# EAGLE design Top board (EAGLE 9.6.2)
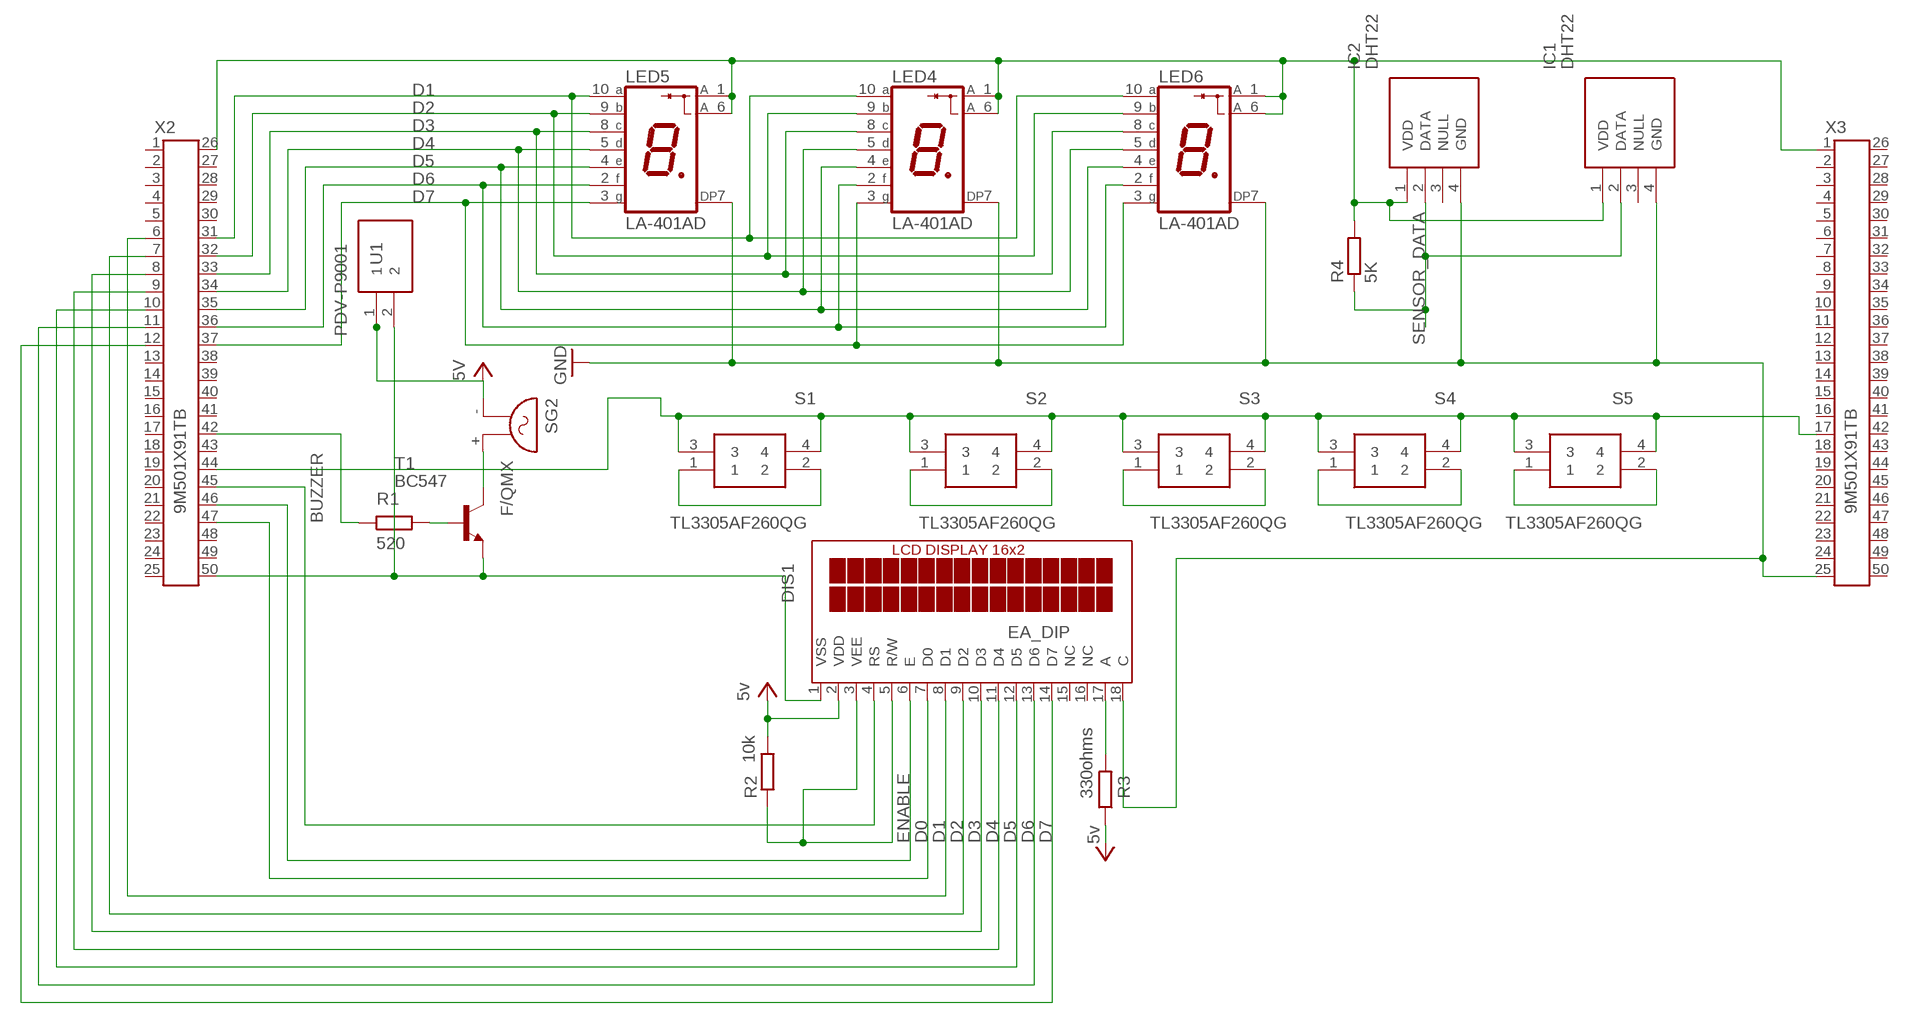
[diagram p0: schematic, sheet 1]

## Parts
DIS1  EA_DIP  [EA_DIP]
IC1  DHT22  [DHT22]
IC2  DHT22  [DHT22]
LED4  LA-401AD  [LA-401]
LED5  LA-401AD  [LA-401]
LED6  LA-401AD  [LA-401]
R1  520  R  (no package)
R2  10k  R-EU_0204/2V  [0204V]
R3  330ohms  R-EU_0204/2V  [0204V]
R4  5K  R-EU_0204/2V  [0204V]
S1  TL3305AF260QG  [TL3305AF160QG]
S2  TL3305AF260QG  [TL3305AF160QG]
S3  TL3305AF260QG  [TL3305AF160QG]
S4  TL3305AF260QG  [TL3305AF160QG]
S5  TL3305AF260QG  [TL3305AF160QG]
SG2  F/QMX  [F/QMX]
T1  BC547  [TO92]
U1  PDV-P9001  [PDVP9001]
X2  9M501X91TB  [9M501X91]
X3  9M501X91TB  [9M501X91]

## Nets
BUZZER: R1.1 X2.42
D0: DIS1.7(D0) X2.47
D1: DIS1.8(D1) LED4.10(A) LED5.10(A) LED6.10(A) X2.6 X2.31
D2: DIS1.9(D2) LED4.9(B) LED5.9(B) LED6.9(B) X2.7 X2.32
D3: DIS1.10(D3) LED4.8(C) LED5.8(C) LED6.8(C) X2.8 X2.33
D4: DIS1.11(D4) LED4.5(D) LED5.5(D) LED6.5(D) X2.9 X2.34
D5: DIS1.12(D5) LED4.4(E) LED5.4(E) LED6.4(E) X2.10 X2.35
D6: DIS1.13(D6) LED4.2(F) LED5.2(F) LED6.2(F) X2.11 X2.36
D7: DIS1.14(D7) LED4.3(G) LED5.3(G) LED6.3(G) X2.12 X2.37
ENABLE: DIS1.6(E) X2.46
GND: DIS1.18(C) IC1.4(GND) IC2.4(GND) LED4.7(DP) LED5.7(DP) LED6.7(DP) X3.25
N$1: R1.2 T1.2(B)
N$2: SG2.+ T1.3(C)
N$4: DIS1.4(RS) X2.45
N$5: DIS1.3(VEE) DIS1.5(R/W) R2.1
N$6: DIS1.1(VSS) T1.1(E) U1.2 X2.50
N$7: S1.3 S1.4 S2.3 S2.4 S3.3 S3.4 S4.3 S4.4 S5.3 S5.4 X2.44 X3.17
N$10: IC1.1(VDD) IC2.1(VDD) LED4.1(A) LED4.6(A) LED5.1(A) LED5.6(A) LED6.1(A) LED6.6(A) R4.2 X2.26 X3.1
N$12: S1.1 S1.2
N$23: DIS1.17(A) R3.2
N$25: S2.1 S2.2
N$26: S3.1 S3.2
N$29: S4.1 S4.2
N$31: S5.1 S5.2
SENSOR_DATA: IC1.2(DATA) IC2.2(DATA) R4.1
VCC: DIS1.2(VDD) R2.2 R3.1 SG2.- U1.1 ; supply symbol labelled 5V, 5v
Unconnected: DIS1.15(NC) DIS1.16(NC) IC1.3(NULL) IC2.3(NULL) X2.1 X2.2 X2.3 X2.4 X2.5 X2.13 X2.14 X2.15 X2.16 X2.17 X2.18 X2.19 X2.20 X2.21 X2.22 X2.23 X2.24 X2.25 X2.27 X2.28 X2.29 X2.30 X2.38 X2.39 X2.40 X2.41 X2.43 X2.48 X2.49 X3.2 X3.3 X3.4 X3.5 X3.6 X3.7 X3.8 X3.9 X3.10 X3.11 X3.12 X3.13 X3.14 X3.15 X3.16 X3.18 X3.19 X3.20 X3.21 X3.22 X3.23 X3.24 X3.26 X3.27 X3.28 X3.29 X3.30 X3.31 X3.32 X3.33 X3.34 X3.35 X3.36 X3.37 X3.38 X3.39 X3.40 X3.41 X3.42 X3.43 X3.44 X3.45 X3.46 X3.47 X3.48 X3.49 X3.50

## Library data of the parts
DIS1 = display-lcd:EA_DIP: LCD-MODUL 2x16 - 6,68mm, INKL. KONTROLLER HD44780 Source: Data sheet <http://www.lcd-module.de/pdf/doma/dip162-d.pdf>
IC1 IC2 = DHT22:DHT22: Digital-output relative humidity & temperature sensor/module DHT22 Source: Datasheet <https://datasheet4u.com/datasheet-parts/DHT22-datasheet.php?id=792211>; ARROW_PART_NUMBER: DHT22; DESCRIPTION: Digital-output relative humidity & temperature sensor/module DHT22; HEIGHT: 25.1mm; MANUFACTURER_NAME: Aosong Electronics; MANUFACTURER_PART_NUMBER: DHT22
LED4-LED6 = led-7-segment:LA-401*D: Single Digit LED Numeric Display (anode common) Source: ROHM .. la-1401dn.pdf; OC_FARNELL: unknown; OC_NEWARK: unknown
R1 = ngspice-simulation:R: RESISTOR
R2-R4 = rcl:R-EU_: RESISTOR, European symbol; SPICEPREFIX: R
S1-S5 = TL3305AF260QG:TL3305AF260QG: E-SWITCH - TL3305AF260QG - TACTILE SW, SPST, 0.05A, 12VDC, SOLDER Source: Datasheet <https://componentsearchengine.com/Datasheets/1/TL3305AF260QG.pdf>; ARROW_PART_NUMBER: TL3305AF260QG; DESCRIPTION: E-SWITCH - TL3305AF260QG - TACTILE SW, SPST, 0.05A, 12VDC, SOLDER; HEIGHT: mm; MANUFACTURER_NAME: E-Switch; MANUFACTURER_PART_NUMBER: TL3305AF260QG; MOUSER_PART_NUMBER: 612-TL3305AF260QG; MOUSER_PRICE-STOCK: https://www.mouser.co.uk/ProductDetail/E-Switch/TL3305AF260QG?qs=UrFqKgNWc7QGfGfc5KSA7A%3D%3D
SG2 = buzzer:F/QMX: BUZZER Source: Buerklin; OC_FARNELL: unknown; OC_NEWARK: unknown
T1 = transistor:BC547: NPN TRANSISTOR
U1 = PDV-P9001:PDV-P9001: PHOTOCELL 4K-11K OHM 4.20MM Source: Datasheet <https://media.digikey.com/pdf/Data Sheets/Photonic Detetectors Inc PDFs/PDV-P9001.pdf>; ARROW_PART_NUMBER: PDV-P9001; DESCRIPTION: PHOTOCELL 4K-11K OHM 4.20MM; HEIGHT: 1.88mm; MANUFACTURER_NAME: Luna Optoelectronics; MANUFACTURER_PART_NUMBER: PDV-P9001
X2 X3 = con-3m:9M501X91TB: CONNECTOR PCMCIA-CompactFlash; OC_FARNELL: unknown; OC_NEWARK: unknown

## Board
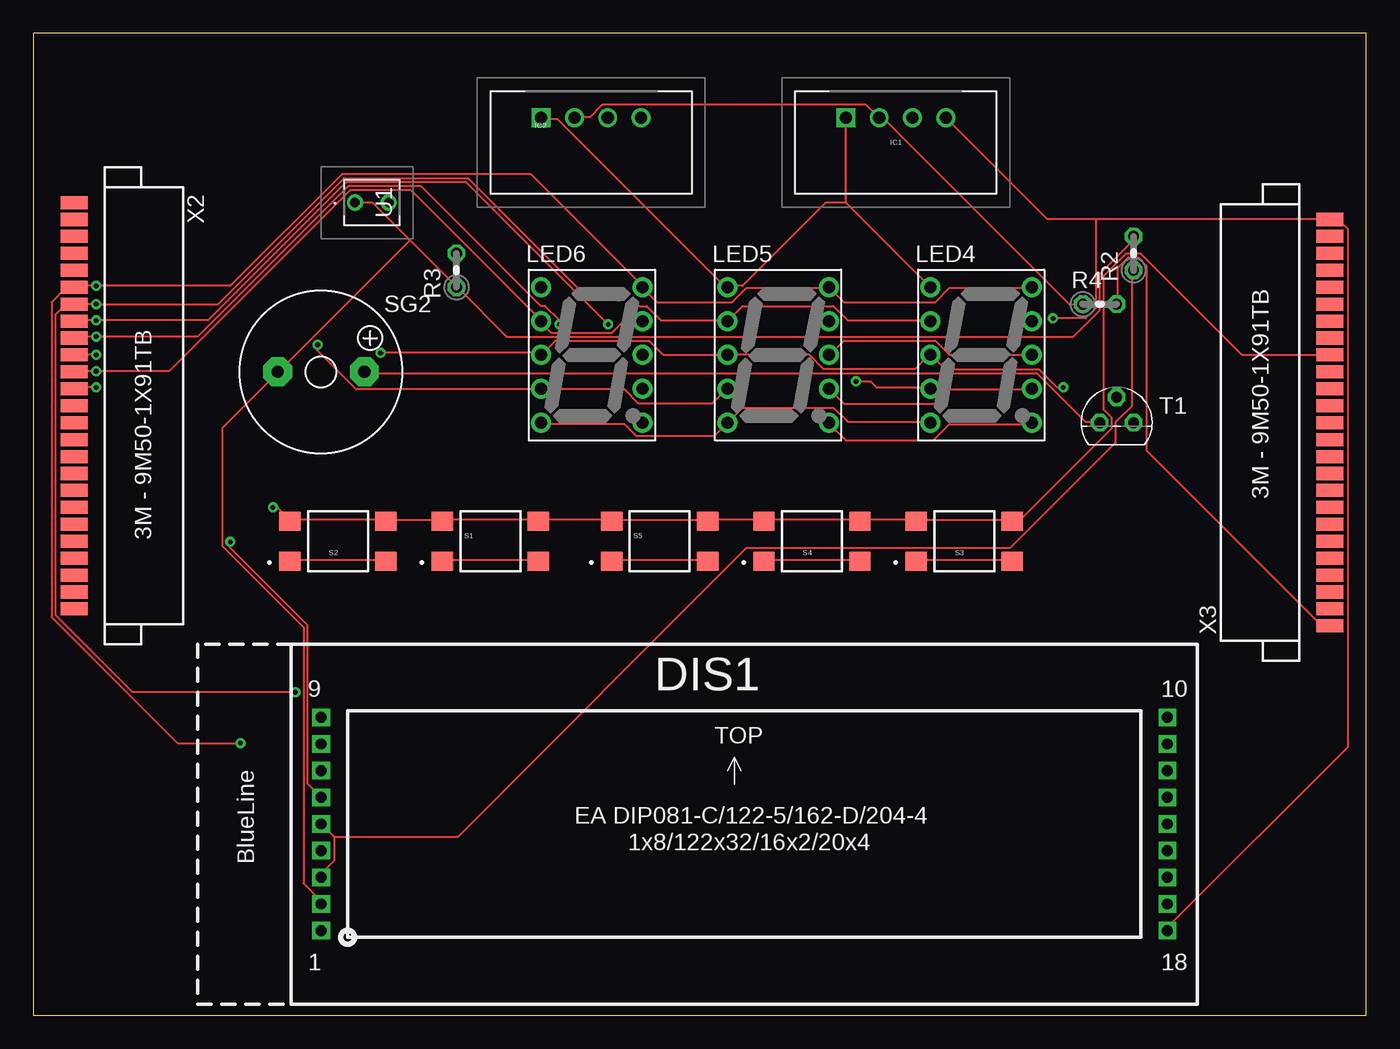
[diagram p1: board, top side]
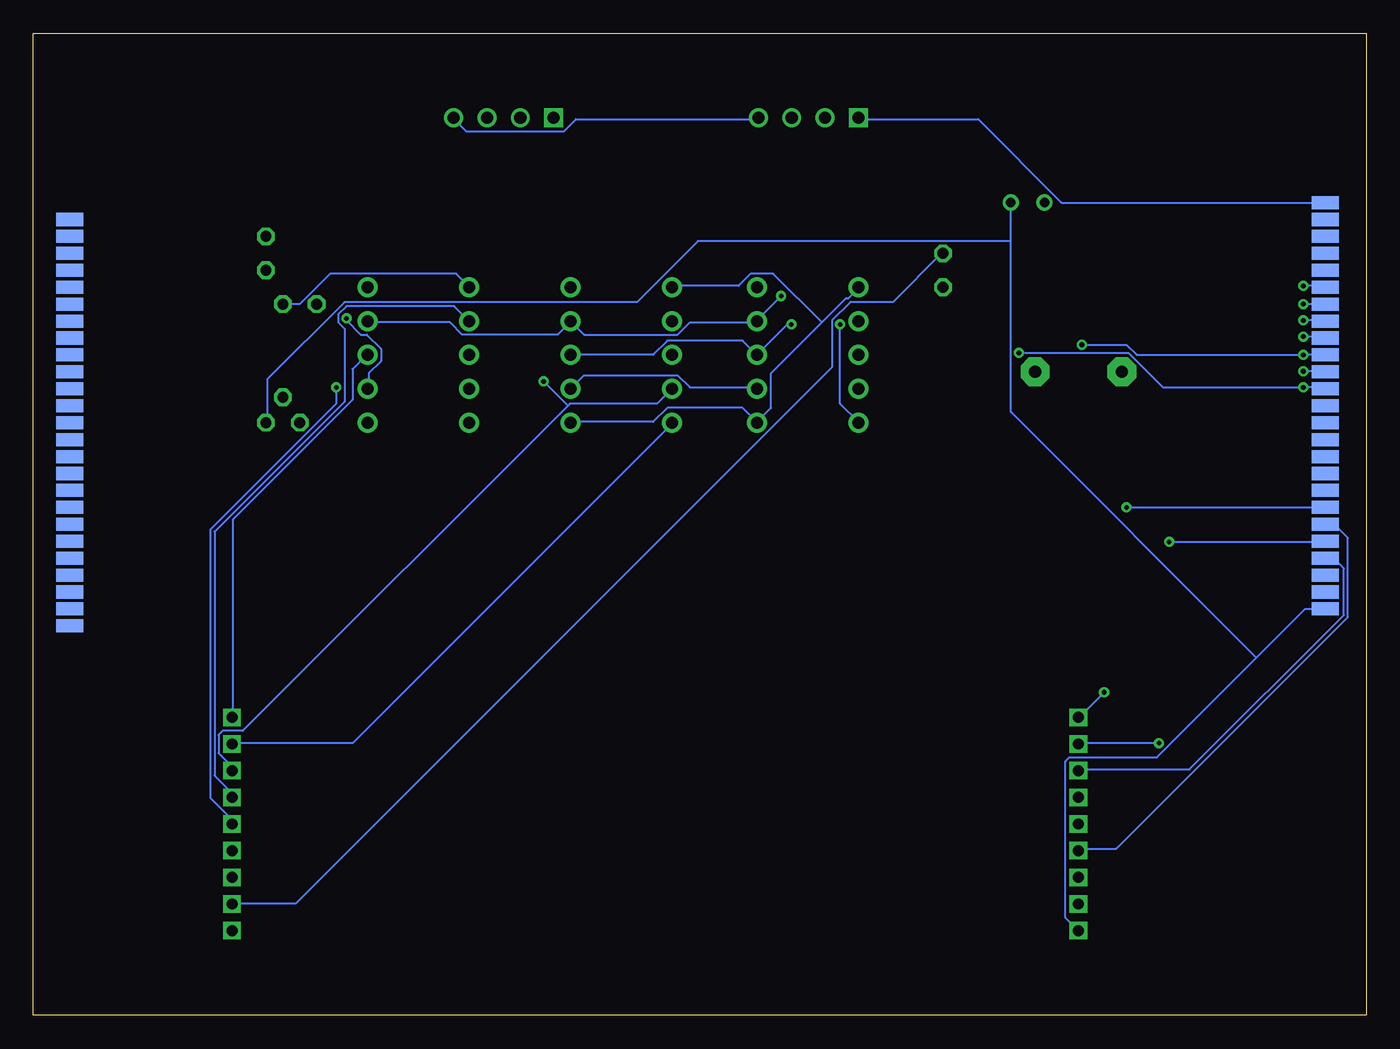
[diagram p2: board, bottom side, seen from below]

Size 100 x 73.65 mm. Coordinates in mm from the lower left corner, seen from the top.
Outline: 0,0 100,0 100,73.65 0,73.65 0,0
Copper layers (1*16): Top 0.035mm / dielectric 1.5mm / Bottom 0.035mm
Design rules "default": minimum track width 6mil, minimum drill 0.35mm, track to track 6mil, track to pad 6mil, pad to pad 6mil, via to via 6mil, smd to smd 6mil, copper to edge 40mil, drill to drill 6mil, minimum pad ring 10mil, minimum via ring 8mil, stop-mask expansion 4mil, vias tented up to drill 0mil, thermal gap 10mil

### Footprints (pad centres in the part's own frame; a part is rotated, then mirrored left to right if it is on the bottom)
EA_DIP = drill 0.813 pad 1.27 square: 1 0,0; 2 0,2; 3 0,4; 4 0,6; 5 0,8; 6 0,10; 7 0,12; 8 0,14; 9 0,16; 10 63.5,16; 11 63.5,14; 12 63.5,12; 13 63.5,10; 14 63.5,8; 15 63.5,6; 16 63.5,4; 17 63.5,2; 18 63.5,0
DHT22 = drill 0.91 pad 1.416 square: 1 0,0 | drill 0.91 pad 1.416: 2 2.5,0; 3 5,0; 4 7.5,0
LA-401 = drill 0.9 pad 1.5: 1 -3.81,5.08; 2 -3.81,2.54; 3 -3.81,0; 4 -3.81,-2.54; 5 -3.81,-5.08; 6 3.81,-5.08; 7 3.81,-2.54; 8 3.81,0; 9 3.81,2.54; 10 3.81,5.08
0204V = drill 0.813 octagon: 1 -1.27,0; 2 1.27,0
TL3305AF160QG = smd 1.6 x 1.4: 1 -3.6,-1.5; 2 3.6,-1.5; 3 -3.6,1.5; 4 3.6,1.5
F/QMX = drill 0.914 pad 2.159 octagon: + 3.251,0; - -3.251,0
TO92 = drill 0.813 octagon: 1 1.27,0; 2 0,1.905; 3 -1.27,0
PDVP9001 = drill 0.7 pad 1.2: 1 0,0; 2 0,-2.54
9M501X91 = smd 0.98 x 2.03: 1 -15.24,-3.29; 2 -13.97,-3.29; 3 -12.7,-3.29; 4 -11.43,-3.29; 5 -10.16,-3.29; 6 -8.89,-3.29; 7 -7.62,-3.29; 8 -6.35,-3.29; 9 -5.08,-3.29; 10 -3.81,-3.29; 11 -2.54,-3.29; 12 -1.27,-3.29; 13 0,-3.29; 14 1.27,-3.29; 15 2.54,-3.29; 16 3.81,-3.29; 17 5.08,-3.29; 18 6.35,-3.29; 19 7.62,-3.29; 20 8.89,-3.29; 21 10.16,-3.29; 22 11.43,-3.29; 23 12.7,-3.29; 24 13.97,-3.29; 25 15.24,-3.29 | smd 0.98 x 2.03 bottom: 26 -15.24,-3.29; 27 -13.97,-3.29; 28 -12.7,-3.29; 29 -11.43,-3.29; 30 -10.16,-3.29; 31 -8.89,-3.29; 32 -7.62,-3.29; 33 -6.35,-3.29; 34 -5.08,-3.29; 35 -3.81,-3.29; 36 -2.54,-3.29; 37 -1.27,-3.29; 38 0,-3.29; 39 1.27,-3.29; 40 2.54,-3.29; 41 3.81,-3.29; 42 5.08,-3.29; 43 6.35,-3.29; 44 7.62,-3.29; 45 8.89,-3.29; 46 10.16,-3.29; 47 11.43,-3.29; 48 12.7,-3.29; 49 13.97,-3.29; 50 15.24,-3.29

### Placement (x,y rotation side)
DIS1  21.59,6.35 0 top
IC1  60.96,67.31 0 top
IC2  38.1,67.31 0 top
LED4  71.12,49.53 0 top
LED5  55.88,49.53 0 top
LED6  41.91,49.53 0 top
R2  82.55,57.15 90 top
R3  31.75,55.88 90 top
R4  80.01,53.34 0 top
S1  34.29,35.56 0 top
S2  22.86,35.56 0 top
S3  69.85,35.56 0 top
S4  58.42,35.56 0 top
S5  46.99,35.56 0 top
SG2  21.59,48.26 0 top
T1  81.28,44.45 0 top
U1  24.13,60.96 90 top
X2  6.35,45.72 270 top
X3  93.98,44.45 90 top

### Tracks (layer width: path | path; a pad name or v marks a point on that pad's centre or on a via)
D0
  Bottom 0.152: X2.47 2.44,34.29 1.68,33.53 1.68,30.02 13.26,18.44 21.49,18.44 DIS1.7
D1  (via drill 0.35)
  Top 0.152: v15.54,20.42 10.82,20.42 1.37,29.87 1.37,53.49 2.44,54.56 3.05,54.56 X2.31 3.2,54.71 v4.72,54.71 14.78,54.71 23.16,63.09 37.34,63.09 45.72,54.71 LED6.10 45.72,54.56 46.79,53.49 52.43,53.49 53.49,54.56 59.59,54.56 LED5.10 60.81,53.49 67.67,53.49 68.73,54.56 74.83,54.56 LED4.10
  Bottom 0.152: v4.72,54.71 3.2,54.71 X2.31 | v15.54,20.42 21.49,20.42 DIS1.8
D2  (via drill 0.35)
  Top 0.152: v19.66,24.23 7.47,24.23 1.68,30.02 1.68,52.58 2.44,53.34 X2.32 v4.72,53.34 13.87,53.34 23.32,62.79 32.61,62.79 41.45,53.95 v43.89,53.95
  Bottom 0.152: LED4.9 74.83,51.97 68.73,51.97 67.82,51.05 60.66,51.05 59.74,51.97 LED5.9 58.67,51.05 51.66,51.05 50.75,51.97 45.72,51.97 LED6.9 45.72,52.12 v43.89,53.95 | X2.32 v4.72,53.34 | v19.66,24.23 21.49,22.4 DIS1.9
D3  (via drill 0.35)
  Top 0.152: X2.33 3.2,52.12 v4.72,52.12 13.11,52.12 23.47,62.48 32.46,62.48 v43.13,51.82 | LED4.8 68.73,49.53 67.67,50.6 60.81,50.6 59.74,49.53 LED5.8
  Bottom 0.152: DIS1.10 85.04,22.4 85.04,37.19 76.05,46.18 76.05,48.46 74.98,49.53 LED4.8 | v4.72,52.12 3.2,52.12 X2.33 | v43.13,51.82 43.43,51.82 LED6.8 46.79,50.6 52.43,50.6 53.49,49.53 LED5.8
D4  (via drill 0.35)
  Top 0.152: X2.34 3.2,50.9 v4.72,50.9 12.34,50.9 23.62,62.18 29.11,62.18 38.1,53.19 38.41,53.19 39.47,52.12 v39.47,51.82 | LED4.5 67.21,44.5 61.11,44.5 60.05,45.57 53.19,45.57 LED5.5 51.05,43.43 45.26,43.43 44.35,44.35 38.1,44.35 LED6.5
  Bottom 0.152: v4.72,50.9 3.2,50.9 X2.34 | v39.47,51.82 39.47,45.87 38.1,44.5 LED6.5 | DIS1.11 85.04,20.42 76.05,20.42 52.12,44.35 LED5.5
D5  (via drill 0.35)
  Top 0.152: v4.72,49.53 X2.35 | v21.34,50.29 21.34,49.84 24.23,46.94 38.1,46.94 | v61.72,47.55 62.79,47.55 63.25,47.09 67.21,47.09 LED4.4 | 38.1,46.94 44.35,46.94 45.41,45.87 50.9,45.87 51.97,46.94 LED5.4 | 38.1,46.94 LED6.4
  Bottom 0.152: X2.35 v4.72,49.53 17.22,49.53 17.98,50.29 v21.34,50.29 | 59.89,45.72 59.74,45.87 53.19,45.87 LED5.4 | 59.89,45.72 84.28,21.34 85.8,21.34 86.11,21.03 86.11,19.66 85.19,18.75 85.19,18.44 DIS1.12 | 59.89,45.72 v61.72,47.55
D6  (via drill 0.35)
  Top 0.152: X2.36 3.2,48.31 v4.72,48.31 10.21,48.31 23.77,61.87 28.35,61.87 38.1,52.12 LED6.2 38.1,51.97 38.86,51.21 43.43,51.21 45.41,53.19 46.02,53.19 47.09,52.12 51.97,52.12 LED5.2 53.19,53.19 60.05,53.19 61.11,52.12 67.21,52.12 LED4.2
  Bottom 0.152: LED4.2 68.43,53.19 76.5,53.19 77.11,52.58 77.11,51.97 76.66,51.51 76.66,46.02 86.41,36.27 86.41,17.98 85.19,16.76 85.19,16.46 DIS1.13 | v4.72,48.31 3.2,48.31 X2.36
D7  (via drill 0.35)
  Top 0.152: v4.72,47.09 3.2,47.09 X2.37 | v26.06,49.68 37.95,49.68 LED6.3 39.17,50.6 46.18,50.6 47.24,49.53 LED5.3 58.22,49.53 59.28,48.46 66.14,48.46 67.21,49.53 LED4.3 67.36,49.53 68.43,48.46 75.44,48.46 76.81,47.09 v77.27,47.09
  Bottom 0.152: X2.37 3.2,47.09 v4.72,47.09 15.24,47.09 17.83,49.68 v26.06,49.68 | v77.27,47.09 77.27,45.87 86.72,36.42 86.72,16.31 85.19,14.78 85.19,14.48 DIS1.14
ENABLE  (via drill 0.35)
  Top 0.152: v14.78,35.51 14.78,35.05 20.57,29.26 20.57,17.37 21.49,16.46 DIS1.6
  Bottom 0.152: v14.78,35.51 3.2,35.51 X2.46
GND  (via drill 0.35)
  Top 0.152: LED5.7 60.81,45.87 67.67,45.87 68.73,46.94 74.83,46.94 LED4.7 | 79.7,59.74 76.05,59.74 68.58,67.21 IC1.4 | 79.7,59.74 97.23,59.74 X3.25 97.38,59.59 97.99,59.59 98.6,58.98 98.6,20.12 85.19,6.71 85.19,6.4 DIS1.18 | v76.5,52.27 78.94,52.27 79.7,53.03 79.7,59.74
  Bottom 0.152: LED5.7 58.67,48.01 51.66,48.01 50.75,47.09 45.72,47.09 LED6.7 | IC2.4 45.72,67.21 59.28,67.21 60.2,66.29 67.51,66.29 68.43,67.21 IC1.4 | v76.5,52.27 76.5,52.12 75.44,51.05 74.98,51.05 73.91,49.99 73.91,49.07 74.83,48.16 74.83,47.09 LED4.7
N$2
  Top 0.152: T1.3 80.01,44.5 78.94,44.5 75.29,48.16 24.84,48.16 SG2.+
N$4
  Bottom 0.152: X2.45 3.05,36.73 2.29,36.73 1.37,35.81 1.37,29.87 18.75,12.5 21.49,12.5 DIS1.4
N$5
  Top 0.152: 22.55,13.41 22.55,11.58 21.64,10.67 21.64,10.36 DIS1.3 | 22.55,13.41 21.64,14.33 DIS1.5 | 22.55,13.41 31.85,13.41 53.49,35.05 73.3,35.05 81.23,42.98 81.23,44.5 82.45,45.72 82.45,55.78 R2.1
N$6
  Bottom 0.152: X2.50 4.57,30.48 8.23,26.82 | 8.23,26.82 15.7,19.36 22.25,19.36 22.55,19.05 22.55,7.32 DIS1.1 | 26.67,58.06 26.67,45.26 8.23,26.82 | 26.67,58.06 U1.2 | 26.67,58.06 50.14,58.06 54.71,53.49 76.66,53.49 82.45,47.7 82.45,44.5 T1.1
N$7  (via drill 0.35)
  Top 0.152: v17.98,38.1 18.29,38.1 19.2,37.19 S2.3 19.36,37.19 26.36,37.19 S2.4 26.52,37.19 30.63,37.19 S1.3 30.79,37.19 37.8,37.19 S1.4 37.95,37.19 43.28,37.19 S5.3 43.43,37.19 50.44,37.19 S5.4 50.6,37.19 54.71,37.19 S4.3 54.86,37.19 61.87,37.19 S4.4 62.03,37.19 66.14,37.19 S3.3 66.29,37.19 73.3,37.19 S3.4 73.46,37.19 74.07,37.19 80.92,44.04 80.92,44.81 80.31,45.41 80.31,55.47 81.99,57.15 83.06,57.15 90.68,49.53 X3.17
  Bottom 0.152: v17.98,38.1 X2.44
N$10
  Top 0.152: X3.1 97.23,29.26 96.62,29.26 83.52,42.37 83.52,56.24 82.91,56.84 82.14,56.84 81.38,56.08 81.38,53.34 R4.2 | 60.96,60.96 IC1.1 | LED4.1 60.96,60.96 | 60.96,60.96 59.44,60.96 53.19,54.71 52.12,54.71 LED5.1 51.97,54.56 39.32,67.21 38.1,67.21 IC2.1 | LED4.6 74.83,44.35 68.73,44.35 67.51,43.13 60.96,43.13 59.74,44.35 LED5.6
  Bottom 0.152: X2.26 22.86,60.96 29.11,67.21 38.1,67.21 IC2.1 | 40.84,51.97 44.65,48.16 44.65,45.57 45.72,44.5 | 40.84,51.97 39.01,53.8 38.86,53.8 38.1,54.56 LED6.1 | 45.72,44.5 46.79,45.57 52.43,45.57 53.49,44.5 59.59,44.5 LED5.6 | 45.72,44.5 LED6.6 | 40.84,51.97 44.5,55.63 46.18,55.63 47.09,54.71 51.97,54.71 LED5.1 | R4.2 80.01,53.34 77.72,55.63 68.28,55.63 67.36,54.71 LED4.1
N$12
  Top 0.152: S1.1 30.79,34.14 37.8,34.14 S1.2
N$23
  Bottom 0.152: DIS1.17 85.04,8.38 80.31,8.38 40.08,48.62 40.08,52.12 38.71,53.49 35.51,53.49 31.85,57.15 R3.2
N$25
  Top 0.152: S2.1 19.36,34.14 26.36,34.14 S2.2
N$26
  Top 0.152: S3.1 66.29,34.14 73.3,34.14 S3.2
N$29
  Top 0.152: S4.1 54.86,34.14 61.87,34.14 S4.2
N$31
  Top 0.152: S5.1 43.43,34.14 50.44,34.14 S5.2
SENSOR_DATA
  Top 0.152: R4.1 77.72,53.34 63.86,67.21 63.55,67.21 IC1.2 63.4,67.36 62.48,68.28 42.67,68.28 41.76,67.36 40.69,67.36 IC2.2
VCC
  Top 0.152: DIS1.2 21.49,8.38 21.49,8.69 20.27,9.91 20.27,29.11 14.17,35.2 14.17,44.04 18.29,48.16 SG2.- 18.44,48.31 28.19,58.06 28.19,58.22 | U1.1 25.45,60.96 28.19,58.22 | 28.19,58.22 31.7,54.71 R3.1 31.85,54.56 35.51,50.9 78.03,50.9 80.01,52.88 80.01,55.63 82.45,58.06 82.45,58.37 R2.2